# EAGLE design ibdtia (EAGLE 9.4.2)
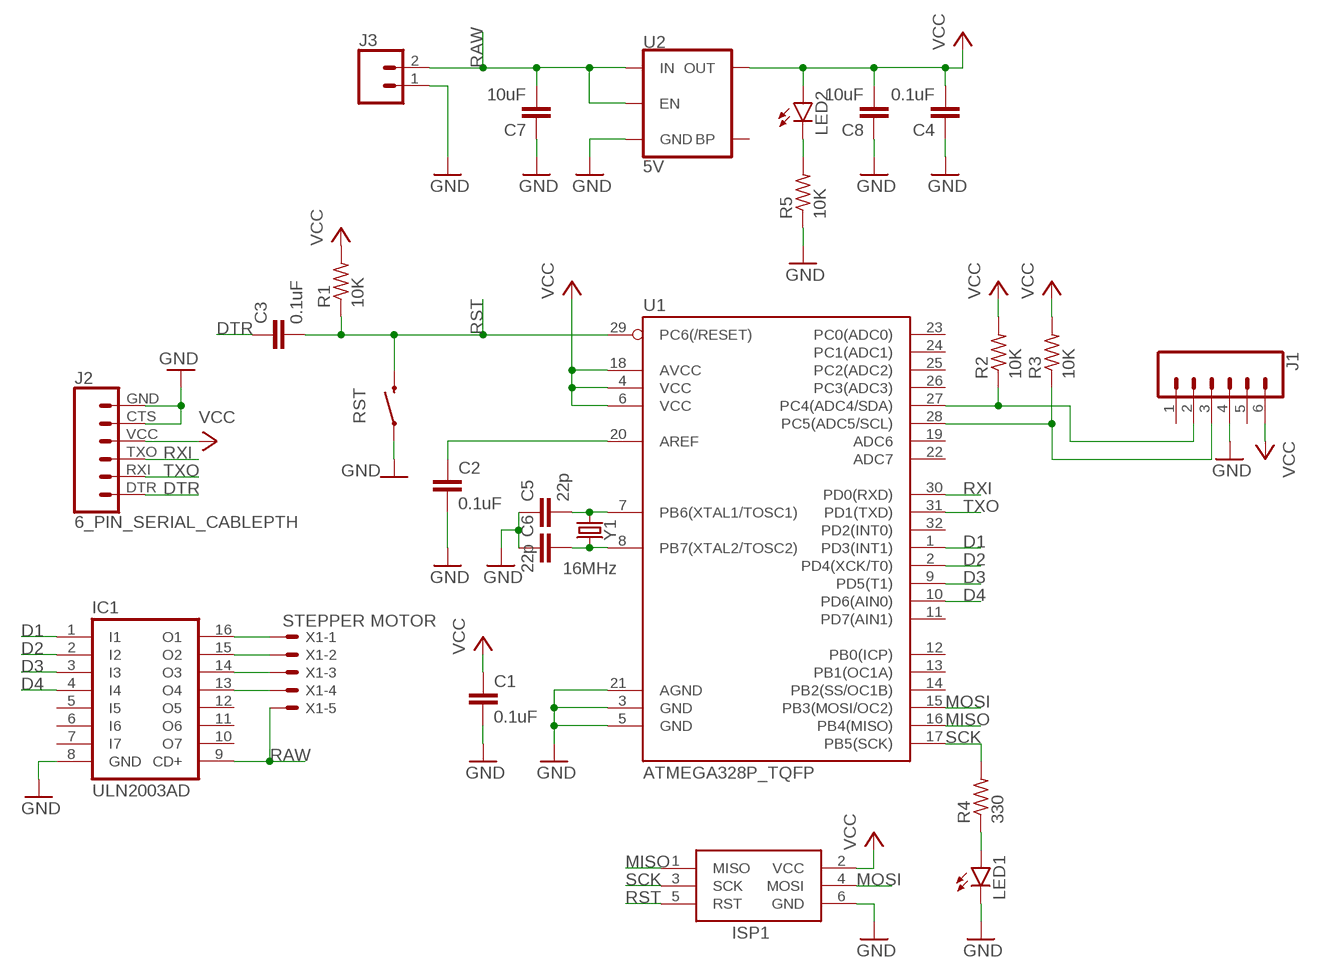
[diagram p0: schematic, sheet 1]

## Parts
C1  0.1uF  C-EUC0805  [C0805]
C2  0.1uF  C-EUC0805  [C0805]
C3  0.1uF  C-EUC0805  [C0805]
C4  0.1uF  C-EUC0805  [C0805]
C5  22p  C-EUC0805  [C0805]
C6  22p  C-EUC0805  [C0805]
C7  10uF  C-EUC0805  [C0805]
C8  10uF  C-EUC0805  [C0805]
IC1  ULN2003AD  [SO16]
ISP1  AVRISP-6  [AVRISP]
J1  CONN_06NO_SILK_FEMALE_PTH  [1X06_NO_SILK]
J2  6_PIN_SERIAL_CABLEPTH  [FTDI_BASIC]
J3  CONN_02  [1X02]
LED1  LEDCHIP-LED0805  [CHIP-LED0805]
LED2  LEDCHIP-LED0805  [CHIP-LED0805]
R1  10K  R-US_R0805  [R0805]
R2  10K  R-US_R0805  [R0805]
R3  10K  R-US_R0805  [R0805]
R4  330  R-US_R0805  [R0805]
R5  10K  R-US_R0805  [R0805]
RST  MOMENTARY-SWITCH-SPST-SMD-4.5MM  [TACTILE_SWITCH_SMD_4.5MM]
U1  ATMEGA328P_TQFP  [TQFP32-08]
U2  5V  V_REG_MIC52055V  [SOT23-5]
X1  STEPPER MOTOR  JST-XH-05-PIN-ROUND-PAD  [JST-XH-05-PACKAGE-ROUND-PAD]
Y1  16MHz  CRYSTAL-16MHZSMD-5X3.2  [CRYSTAL-SMD-5X3.2-4PAD]

## Nets
D1: IC1.1(I1) U1.1(PD3(INT1))
D2: IC1.2(I2) U1.2(PD4(XCK/T0))
D3: IC1.3(I3) U1.9(PD5(T1))
D4: IC1.4(I4) U1.10(PD6(AIN0))
DTR: C3.1 J2.DTR
GND: C1.2 C2.2 C4.1 C5.1 C6.1 C7.1 C8.1 IC1.8(GND) ISP1.6(GND) J1.4 J2.CTS J2.GND J3.1 LED1.C R5.1 RST.2 RST.3 U1.3(GND) U1.5(GND) U1.21(AGND) U2.2(GND)
MISO: ISP1.1(MISO) U1.16(PB4(MISO))
MOSI: ISP1.4(MOSI) U1.15(PB3(MOSI/OC2))
N$2: IC1.16(O1) X1.1
N$3: C5.2 U1.7(PB6(XTAL1/TOSC1)) Y1.1
N$4: C2.1 U1.20(AREF)
N$5: C6.2 U1.8(PB7(XTAL2/TOSC2)) Y1.3
N$6: J1.2 R2.1 U1.27(PC4(ADC4/SDA))
N$7: J1.3 R3.1 U1.28(PC5(ADC5/SCL))
N$8: IC1.15(O2) X1.2
N$9: LED1.A R4.1
N$10: IC1.14(O3) X1.3
N$11: IC1.13(O4) X1.4
N$12: LED2.C R5.2
RAW: C7.2 IC1.9(CD+) J3.2 U2.1(IN) U2.3(EN) X1.5
RST: C3.2 ISP1.5(RST) R1.1 RST.1 RST.4 U1.29(PC6(/RESET))
RXI: J2.TXO U1.30(PD0(RXD))
SCK: ISP1.3(SCK) R4.2 U1.17(PB5(SCK))
TXO: J2.RXI U1.31(PD1(TXD))
VCC: C1.1 C4.2 C8.2 ISP1.2(VCC) J1.6 J2.VCC LED2.A R1.2 R2.2 R3.2 U1.4(VCC) U1.6(VCC) U1.18(AVCC) U2.5(OUT)
Unconnected: IC1.5(I5) IC1.6(I6) IC1.7(I7) IC1.10(O7) IC1.11(O6) IC1.12(O5) J1.1 J1.5 U1.11(PD7(AIN1)) U1.12(PB0(ICP)) U1.13(PB1(OC1A)) U1.14(PB2(SS/OC1B)) U1.19(ADC6) U1.22(ADC7) U1.23(PC0(ADC0)) U1.24(PC1(ADC1)) U1.25(PC2(ADC2)) U1.26(PC3(ADC3)) U1.32(PD2(INT0)) U2.4(BP)

## Library data of the parts
C1-C8 = rcl:C-EU: CAPACITOR, European symbol; SPICEPREFIX: C
IC1 = uln-udn:ULN2003A: DRIVER ARRAY
ISP1 = adafruit:AVRISP: AVR ISP HEADER Standard 6 pin header for AVR programming
J1 = SparkFun-Connectors:CONN_06: Multi connection point. Often used as Generic Header-pin footprint for 0.1 inch spaced/style header connections On any of the 0.1 inch spaced packages, you can populate with these: Break Away Headers - Straight <https://www.sparkfun.com/products/116> (PRT-00116) Break Away Male Headers - Right Angle <https://www.sparkfun.com/products/553> (PRT-00553) Female Headers <https://www.sparkfun.com/products/115> (PRT-00115) Break Away Headers - Machine Pin <https://www.sparkfun.com/products/117> (PRT-00117) Break Away Female Headers - Swiss Machine Pin <https://www.sparkfun.com/products/743> (PRT-00743) Arduino Stackable Header - 6 Pin <https://www.sparkfun.com/products/9280> (PRT-09280) For SCREWTERMINALS and SPRING TERMINALS visit here: Screw Terimnals on SparkFun.com <https://www.sparkfun.com/search/results?term=Screw+Terminals> (5mm/3.5mm/2.54mm spacing) This device is also useful as a general connection point to wire up your design to another part of your project. Our various solder wires solder well into these plated through hole pads. Hook-Up Wire - Assortment (Stranded, 22 AWG) <https://www.sparkfun.com/products/11375> (PRT-11375) Hook-Up Wire - Assortment (Solid Core, 22 AWG) <https://www.sparkfun.com/products/11367> (PRT-11367) View the entire wire category on our website here <https://www.sparkfun.com/categories/141>; PROD_ID: CONN-08437
J2 = SparkFun-Connectors:6_PIN_SERIAL_CABLE: 6-pin header connection for use with the "FTDI BASIC" pinout - CABLE SIDE. Also known as "Arduino Serial Program Header". This is used on a design to provide a 6-pin connection point for serial communication usually from a USB cable (D+/D-) to these headers (RX/TX). It also has the remaining pins necessary for programming in the Arduino evironment (DTR, GND, and sometimes VCC). Note, this device has "CABLE" in the name. It is intended to be used on a design that usually lives on the end of your USB cable and prvides the converter chip (FTDI232 or FTDI231x) to commnicate serial RX/TX. The "sister" device, named "TARGET" is inteneded to be used on a design that contains a target micro-controller that you wish to program. You can populate with some of these: Female Headers <https://www.sparkfun.com/products/115> (PRT-00115) For reference (or to suit your programming needs) check out these designs: SparkFun FTDI Basic Breakout - 5V <https://www.sparkfun.com/products/9716> (DEV-09716) SparkFun FTDI Basic Breakout - 3.3V <https://www.sparkfun.com/products/9873> (DEV-09873) SparkFun FTDI SmartBasic <https://www.sparkfun.com/products/12935> (DEV-12935) SparkFun Beefy 3 - FTDI Basic Breakout <https://www.sparkfun.com/products/13746> (DEV-13746)
J3 = SparkFun-Connectors:CONN_02: Multi connection point. Often used as Generic Header-pin footprint for 0.1 inch spaced/style header connections On any of the 0.1 inch spaced packages, you can populate with these: Break Away Headers - Straight <https://www.sparkfun.com/products/116> (PRT-00116) Break Away Male Headers - Right Angle <https://www.sparkfun.com/products/553> (PRT-00553) Female Headers <https://www.sparkfun.com/products/115> (PRT-00115) Break Away Headers - Machine Pin <https://www.sparkfun.com/products/117> (PRT-00117) Break Away Female Headers - Swiss Machine Pin <https://www.sparkfun.com/products/743> (PRT-00743) For SCREWTERMINALS and SPRING TERMINALS visit here: Screw Terimnals on SparkFun.com <https://www.sparkfun.com/search/results?term=Screw+Terminals> (5mm/3.5mm/2.54mm spacing) This device is also useful as a general connection point to wire up your design to another part of your project. Our various solder wires solder well into these plated through hole pads. Hook-Up Wire - Assortment (Stranded, 22 AWG) <https://www.sparkfun.com/products/11375> (PRT-11375) Hook-Up Wire - Assortment (Solid Core, 22 AWG) <https://www.sparkfun.com/products/11367> (PRT-11367) View the entire wire category on our website here <https://www.sparkfun.com/categories/141> Special notes: Molex polarized connector foot print use with: PRT-08233 with associated crimp pins and housings. 2.54_SCREWTERM for use with PRT-10571. 3.5mm Screw Terminal footprints for PRT-08084 5mm Screw Terminal footprints for use with PRT-08432
LED1 LED2 = led:LED: LED OSRAM: - CHIPLED LG R971, LG N971, LY N971, LG Q971, LY Q971, LO R971, LY R971 LH N974, LH R974 LS Q976, LO Q976, LY Q976 LO Q996 - Hyper CHIPLED LW Q18S LB Q993, LB Q99A, LB R99A - SideLED LS A670, LO A670, LY A670, LG A670, LP A670 LB A673, LV A673, LT A673, LW A673 LH A674 LY A675 LS A676, LA A676, LO A676, LY A676, LW A676 LS A679, LY A679, LG A679 - Hyper Micro SIDELED® LS Y876, LA Y876, LO Y876, LY Y876 LT Y87S - SmartLED LW L88C, LW L88S LB L89C, LB L89S, LG L890 LS L89K, LO L89K, LY L89K LS L896, LA L896, LO L896, LY L896 - TOPLED LS T670, LO T670, LY T670, LG T670, LP T670 LSG T670, LSP T670, LSY T670, LOP T670, LYG T670 LG T671, LOG T671, LSG T671 LB T673, LV T673, LT T673, LW T673 LH T674 LS T676, LA T676, LO T676, LY T676, LB T676, LH T676, LSB T676, LW T676 LB T67C, LV T67C, LT T67C, LS T67K, LO T67K, LY T67K, LW E67C LS E67B, LA E67B, LO E67B, LY E67B, LB E67C, LV E67C, LT E67C LW T67C LS T679, LY T679, LG T679 LS T770, LO T770, LY T770, LG T770, LP T770 LB T773, LV T773, LT T773, LW T773 LH T774 LS E675, LA E675, LY E675, LS T675 LS T776, LA T776, LO T776, LY T776, LB T776 LHGB T686 LT T68C, LB T68C - Hyper Mini TOPLED® LB M676 - Mini TOPLED Santana® LG M470 LS M47K, LO M47K, LY M47K Source: http://www.osram.convergy.de LUXEON: - LUMILED® LXK2-PW12-R00, LXK2-PW12-S00, LXK2-PW14-U00, LXK2-PW14-V00 LXK2-PM12-R00, LXK2-PM12-S00, LXK2-PM14-U00 LXK2-PE12-Q00, LXK2-PE12-R00, LXK2-PE12-S00, LXK2-PE14-T00, LXK2-PE14-U00 LXK2-PB12-K00, LXK2-PB12-L00, LXK2-PB12-M00, LXK2-PB14-N00, LXK2-PB14-P00, LXK2-PB14-Q00 LXK2-PR12-L00, LXK2-PR12-M00, LXK2-PR14-Q00, LXK2-PR14-R00 LXK2-PD12-Q00, LXK2-PD12-R00, LXK2-PD12-S00 LXK2-PH12-R00, LXK2-PH12-S00 LXK2-PL12-P00, LXK2-PL12-Q00, LXK2-PL12-R00 Source: www.luxeon.com KINGBRIGHT: KA-3528ASYC Source: www.kingbright.com
R1-R5 = rcl:R-US_: RESISTOR, American symbol; SPICEPREFIX: R
RST = SparkFun-Switches:MOMENTARY-SWITCH-SPST: Momentary Switch (Pushbutton) - SPST Normally-open (NO) SPST momentary switches (buttons, pushbuttons). Variants PTH-12MM - 12mm square, through-hole Momentary Pushbutton Switch - 12mm Square <https://www.sparkfun.com/products/9190> (COM-09190) PTH-6.0MM, PTH-6.0MM-KIT - 6.0mm square, through-hole Mini Pushbutton Switch <https://www.sparkfun.com/products/97> (COM-00097) KIT package intended for soldering kit's - only one side of pads' copper is exposed. PTH-RIGHT-ANGLE-KIT - Right-angle, through-hole Right Angle Tactile Button <https://www.sparkfun.com/products/10791> - Used on SparkFun BigTime Watch Kit <https://www.sparkfun.com/products/11734> SMD-12MM - 12mm square, surface-mount Tactile Button - SMD (12mm) <https://www.sparkfun.com/products/12993> (COM-12993) Used on SparkFun PicoBoard <https://www.sparkfun.com/products/11888> SMD-4.5MM - 4.5mm Square Trackball Switch Used on SparkFun Blackberry Trackballer Breakout <https://www.sparkfun.com/products/13169> SMD-4.6MMX2.8MM - 4.60mm x 2.80mm, surface mount Used on SparkFun SAMD21 Mini Breakout <https://www.sparkfun.com/products/13664> SMD-5.2MM, SMD-5.2-REDUNDANT - 5.2mm square, surface-mount Mini Pushbutton Switch - SMD <https://www.sparkfun.com/products/8720> (COM-08720) Used on Arduino Pro Mini <https://www.sparkfun.com/products/11114> REDUNDANT package connects both switch circuits together SMD-6.0X3.5MM - 6.0 x 3.5mm, surface mount Momentary Reset Switch SMD <https://www.sparkfun.com/products/8229> (COM-08229) SMD-6.2MM-TALL - 6.2mm square, surface mount Tactile Button - SMD (6mm) <https://www.sparkfun.com/products/12992> Used on SparkFun Digital Sandbox <https://www.sparkfun.com/products/12651> SMD-RIGHT-ANGLE - Right-angle, surface mount Used on SparkFun Block for Intel® Edison - Arduino <https://www.sparkfun.com/products/13036>; PROD_ID: SWCH-09213
U1 = SparkFun-IC-Microcontroller:ATMEGA328P_TQFP: Popular 328P in QFP Storefront component: ATmega328 - TQFP <https://www.sparkfun.com/products/13448> (COM-13448) Datasheet <http://www.sparkfun.com/datasheets/Components/SMD/ATMega328.pdf> SparkFun Products SparkFun RedBoard - Programmed with Arduino <https://www.sparkfun.com/products/12757> (DEV-12757) Arduino Pro Mini 328 - 5V/16MHz <https://www.sparkfun.com/products/11113> (DEV-11113) Arduino Pro Mini 328 - 3.3V/8MHz <https://www.sparkfun.com/products/11114> (DEV-11114) SparkFun OpenLog <https://www.sparkfun.com/products/13712> (DEV-13712) SparkFun MicroView - OLED Arduino Module <https://www.sparkfun.com/products/12923> (DEV-12923) SparkFun Digital Sandbox <https://www.sparkfun.com/products/12651> (DEV-12651) SparkFun PicoBoard <https://www.sparkfun.com/products/11888> (WIG-11888) Arduino Fio <https://www.sparkfun.com/products/10116> (DEV-10116) LilyPad Arduino 328 Main Board <https://www.sparkfun.com/products/13342> (DEV-13342) SparkFun RedStick <https://www.sparkfun.com/products/13741> (DEV-13741) LilyPad MP3 <https://www.sparkfun.com/products/11013> (DEV-11013) LilyPad Arduino SimpleSnap <https://www.sparkfun.com/products/10941> (DEV-10941) SparkFun Stepoko <https://www.sparkfun.com/products/13899> (ROB-13899) SparkFun Geiger Counter <https://www.sparkfun.com/products/11345> (SEN-11345) SparkFun EL Sequencer <https://www.sparkfun.com/products/12781> (COM-12781) Arduino Pro 328 - 5V/16MHz <https://www.sparkfun.com/products/10915> (DEV-10915) CryptoCape <https://www.sparkfun.com/products/12773> (DEV-12773) SparkFun IR Thermometer Evaluation Board - MLX90614 <https://www.sparkfun.com/products/10740> (SEN-10740) SparkFun RedBot Mainboard <https://www.sparkfun.com/products/12097> (ROB-12097) Arduino Pro 328 - 3.3V/8MHz <https://www.sparkfun.com/products/10914> (DEV-10914) SparkFun Block for Intel® Edison - Arduino <https://www.sparkfun.com/products/13036> (DEV-13036) SparkFun Simon Says - Surface Mount Soldering Kit <https://www.sparkfun.com/products/10935> (KIT-10935) SparkFun 7-Segment Serial Display - Red <https://www.sparkfun.com/products/11441> (COM-11441) SparkFun 7-Segment Serial Display - White <https://www.sparkfun.com/products/11629> (COM-11629) SparkFun 7-Segment Serial Display - Yellow <https://www.sparkfun.com/products/11443> (COM-11443) SparkFun 7-Segment Serial Display - Kelly Green <https://www.sparkfun.com/products/11440> (COM-11440) SparkFun 7-Segment Serial Display - Blue <https://www.sparkfun.com/products/11442> (COM-11442) SparkFun OpenSegment Serial Display - 20mm (Blue) <https://www.sparkfun.com/products/11647> (COM-11647) SparkFun OpenSegment Serial Display - 20mm (Green) <https://www.sparkfun.com/products/11646> (COM-11646) SparkFun OpenSegment Serial Display - 20mm (White) <https://www.sparkfun.com/products/11648> (COM-11648) SparkFun OpenSegment Serial Display - 20mm (Red) <https://www.sparkfun.com/products/11644> (COM-11644) SparkFun OpenSegment Serial Display - 20mm (Yellow) <https://www.sparkfun.com/products/11645> (COM-11645) SparkFun OpenSegment Shield <https://www.sparkfun.com/products/13190> (DEV-13190); PROD_ID: IC-09069
U2 = SparkFun-IC-Power:V_REG_MIC5205: V_REG MIC5205 Standard 3.3V, 5V, and Adjustable 150mA LDO voltage regulator in SOT-23 layout. Micrel part MIC5205. BP (by-pass) pin is used to lower output noise with 470pF cap, may be left open. On the adjustable version BP is used to set output.; PROD_ID: VREG-00823
X1 = Rembrandt Electronics - JST XH Connectors v1-0:JST-XH-05-PIN: JST XH Connector 2 Pin Wire to board connector. Pitch: 2,54 mm, (0.100") Number of pins: 5 Created by Rembrandt Electronics www.rembrandtelectronics.com
Y1 = SparkFun-Clocks:CRYSTAL-16MHZ: 16MHz Crystal Digikey Example <http://www.digikey.com/product-search/en?keywords=535-9122-1-ND> Frequency: 16MHz Frequency Stability: ±50ppm Frequency Tolerance: ±20ppm Load Capacitance: 18pF SparkFun Products: Pro Micro -5V/16MHz <https://www.sparkfun.com/products/12640> SparkFun Serial Enabled LCD Kit <https://www.sparkfun.com/products/10097>; PROD_ID: XTAL-08218; SF_ID: COM-00094

## Board
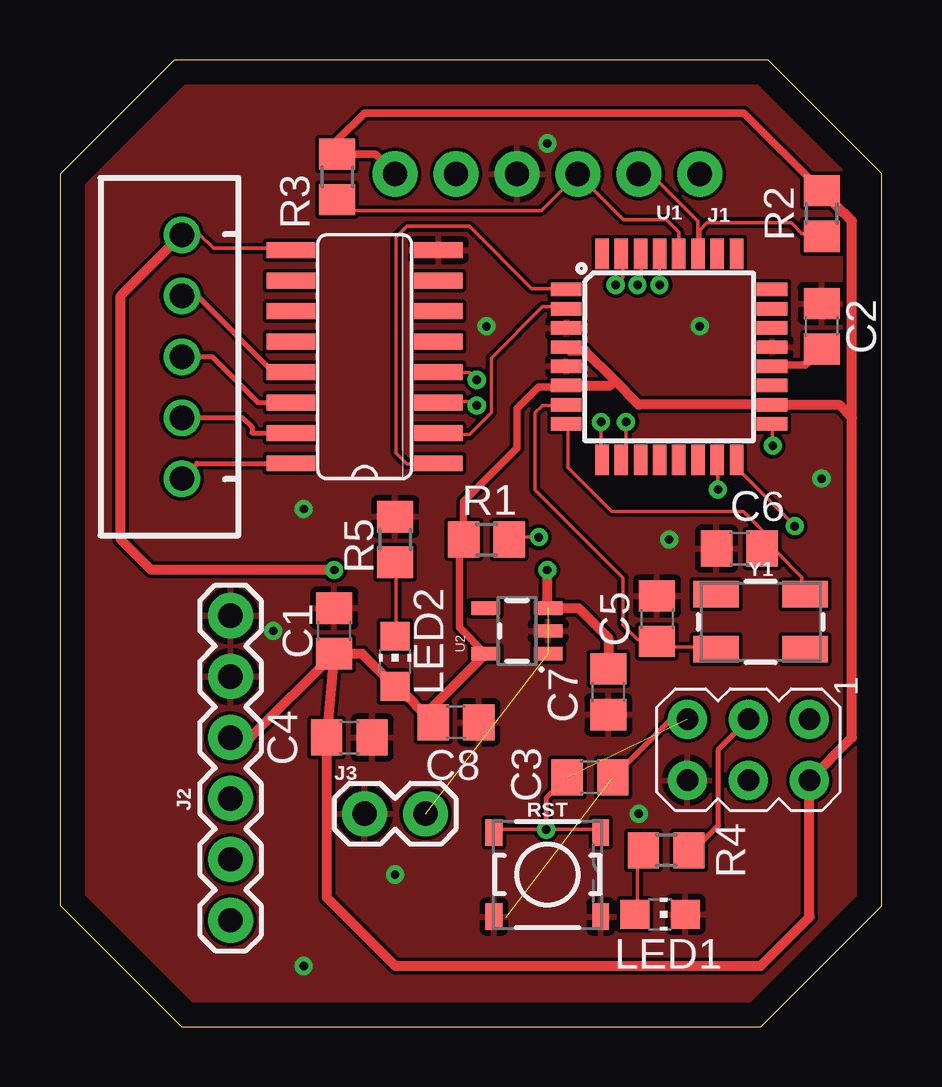
[diagram p1: board, top side]
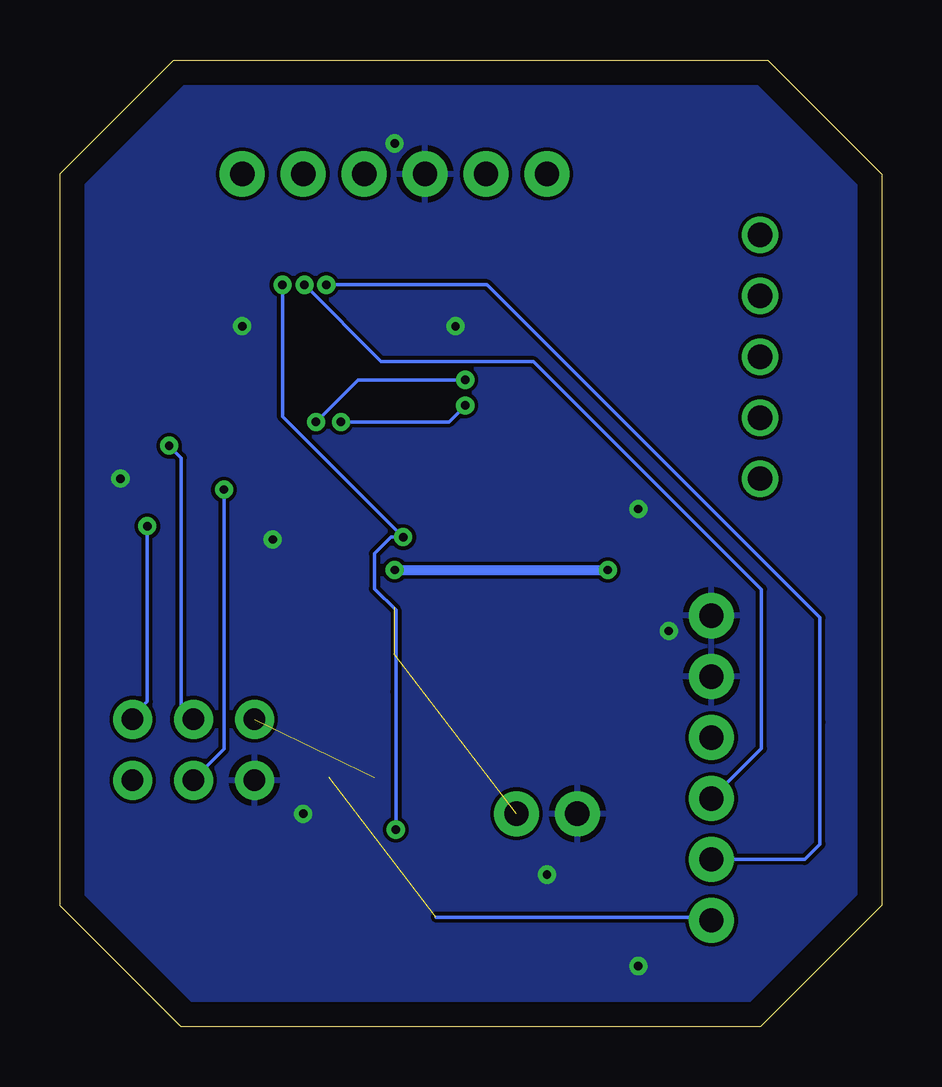
[diagram p2: board, bottom side, seen from below]

Size 34.27 x 40.31 mm. Coordinates in mm from the lower left corner, seen from the top.
Outline: 5.08,0 29.21,0 34.27,5.06 34.27,35.58 29.54,40.31 4.75,40.31 0,35.56 0,5.08 5.08,0
Copper layers (1*16): Top 0.035mm / dielectric 1.5mm / Bottom 0.035mm
Design rules "default": minimum track width 6mil, minimum drill 0.35mm, track to track 6mil, track to pad 6mil, pad to pad 6mil, via to via 6mil, smd to smd 6mil, copper to edge 40mil, drill to drill 6mil, minimum pad ring 10mil, minimum via ring 8mil, stop-mask expansion 4mil, vias tented up to drill 0mil, thermal gap 10mil

### Footprints (pad centres in the part's own frame; a part is rotated, then mirrored left to right if it is on the bottom)
C0805 = smd 1.3 x 1.5: 1 -0.95,0; 2 0.95,0
SO16 = smd 0.66 x 2.032: 1 -4.445,-3.073; 2 -3.175,-3.073; 3 -1.905,-3.073; 4 -0.635,-3.073; 5 0.635,-3.073; 6 1.905,-3.073; 7 3.175,-3.073; 8 4.445,-3.073; 9 4.445,3.073; 10 3.175,3.073; 11 1.905,3.073; 12 0.635,3.073; 13 -0.635,3.073; 14 -1.905,3.073; 15 -3.175,3.073; 16 -4.445,3.073
AVRISP = drill 0.9 pad 1.626: 1 -1.27,2.54; 2 1.27,2.54; 3 -1.27,0; 4 1.27,0; 5 -1.27,-2.54; 6 1.27,-2.54
1X06_NO_SILK = drill 1.016 pad 1.88: 1 0,0; 2 2.54,0; 3 5.08,0; 4 7.62,0; 5 10.16,0; 6 12.7,0
FTDI_BASIC = drill 1.016 pad 1.88: CTS 10.16,0; DTR 0,0; GND 12.7,0; RXI 2.54,0; TXO 5.08,0; VCC 7.62,0
1X02 = drill 1.016 pad 1.88: 1 0,0; 2 2.54,0
CHIP-LED0805 = smd 1.2 x 1.2: A 0,-1.05; C 0,1.05
R0805 = smd 1.3 x 1.5: 1 -0.95,0; 2 0.95,0
TACTILE_SWITCH_SMD_4.5MM = smd 0.7 x 1.1: 1 2.225,1.75; 2 2.225,-1.75; 3 -2.225,-1.75; 4 -2.225,1.75
TQFP32-08 = smd 1.27 x 0.559: 1 -4.293,2.8; 2 -4.293,2; 3 -4.293,1.2; 4 -4.293,0.4; 5 -4.293,-0.4; 6 -4.293,-1.2; 7 -4.293,-2; 8 -4.293,-2.8; 17 4.293,-2.8; 18 4.293,-2; 19 4.293,-1.2; 20 4.293,-0.4; 21 4.293,0.4; 22 4.293,1.2; 23 4.293,2; 24 4.293,2.8 | smd 0.559 x 1.27: 9 -2.8,-4.293; 10 -2,-4.293; 11 -1.2,-4.293; 12 -0.4,-4.293; 13 0.4,-4.293; 14 1.2,-4.293; 15 2,-4.293; 16 2.8,-4.293; 25 2.8,4.293; 26 2,4.293; 27 1.2,4.293; 28 0.4,4.293; 29 -0.4,4.293; 30 -1.2,4.293; 31 -2,4.293; 32 -2.8,4.293
SOT23-5 = smd 0.55 x 1.2: 1 -0.95,-1.3; 2 0,-1.3; 3 0.95,-1.3; 4 0.95,1.3; 5 -0.95,1.3
JST-XH-05-PACKAGE-ROUND-PAD = drill 1.016: 1 -5.08,0; 2 -2.54,0; 3 0,0; 4 2.54,0; 5 5.08,0
CRYSTAL-SMD-5X3.2-4PAD = smd 1.9 x 1.1: 1 -1.85,-1.15; 2 1.85,-1.15; 3 1.85,1.15; 4 -1.85,1.15

### Placement (x,y rotation side)
C1  11.43,16.51 90 top
C2  31.75,29.21 90 top
C3  22.1,10.41 180 top
C4  12.06,12.06 180 top
C5  24.89,17.02 270 top
C6  28.32,19.94 0 top
C7  22.86,13.97 90 top
C8  16.51,12.7 180 top
IC1  12.7,27.94 90 top
ISP1  28.7,11.56 270 top
J1  26.67,35.56 180 top
J2  7.11,4.45 90 top
J3  12.7,8.89 0 top
LED1  25.02,4.7 270 top
LED2  13.97,15.24 0 top
R1  17.78,20.32 180 top
R2  31.75,33.91 90 top
R3  11.56,35.43 90 top
R4  25.27,7.37 0 top
R5  13.97,20.32 270 top
RST  20.32,6.35 0 top
U1  25.4,27.94 0 top
U2  19.05,16.51 90 top
X1  5.08,27.94 90 top
Y1  29.21,16.89 0 top

### Tracks (layer width: path | path; a pad name or v marks a point on that pad's centre or on a via)
D1
  Top 0.152: U1.1 21.03,30.79 19.66,30.79 17.07,33.38 14.48,33.38 14.02,32.92 14.02,23.93 14.48,23.47 15.7,23.47 IC1.1
D2
  Top 0.152: U1.2 21.03,30.02 20.12,30.02 17.98,27.89 17.98,25.6 17.07,24.69 15.85,24.69 IC1.2
D3  (via drill 0.35)
  Top 0.152: v22.55,25.22 22.55,23.77 U1.9 | v17.37,25.91 17.22,26.06 15.85,26.06 IC1.3
  Bottom 0.152: v22.55,25.22 18.06,25.22 v17.37,25.91
D4  (via drill 0.35)
  Top 0.152: v23.6,25.22 23.6,24.01 U1.10 | v17.37,26.98 17.07,27.28 15.85,27.28 IC1.4
  Bottom 0.152: v23.6,25.22 21.84,26.98 v17.37,26.98
DTR  (1 unrouted)
  Top 0.203: C3.1 25.46,12.83
  Bottom 0.152: 18.59,4.57 7.16,4.57 J2.DTR
GND  (via drill 0.35)
  other vias: 13.97,6.35 10.16,2.54 24.13,8.89 10.16,21.59 8.89,16.51 25.4,20.32 31.75,22.86 26.67,29.21 20.32,36.83 17.78,29.21
  pour Top: 0,50.8 40.64,50.8 40.64,-1.27 0,-1.27
  pour Bottom: -1.27,40.64 35.56,40.64 36.83,39.37 36.83,5.08 30.48,-1.27 0,-1.27 -1.27,0
MISO  (via drill 0.35)
  Top 0.152: v30.63,20.88 28.2,23.31 U1.16
  Bottom 0.152: v30.63,20.88 30.63,13.56 31.24,12.95 ISP1.1
MOSI  (via drill 0.35)
  Top 0.152: v27.43,22.4 27.43,23.62 U1.15
  Bottom 0.152: v27.43,22.4 27.43,11.58 28.65,10.36 ISP1.4
N$2
  Top 0.2: X1.1 5.71,23.5 IC1.16
N$3
  Top 0.152: U1.7 21.03,25.91 20.12,25.91 19.81,25.6 19.81,22.38 23.47,18.72 23.47,16.76 24.08,16.15 24.84,16.15 C5.2 24.99,16 25.15,15.85 27.28,15.85 Y1.1
N$4
  Top 0.152: 29.72,27.58 U1.20
  Top 0.305: C2.1 31.07,27.58 29.72,27.58
N$5
  Top 0.152: U1.8 21.18,24.99 21.18,23.32 23.01,21.49 28.5,21.49 29.26,20.73 29.26,19.96 C6.2 29.41,19.81 29.87,19.81 30.94,18.75 30.94,18.14 Y1.3
N$6
  Top 0.152: R2.1 31.7,33.07 30.94,33.07 30.48,33.53 26.98,33.53 26.67,33.22 26.67,32.31 U1.27 26.6,33.6 24.64,35.56 J1.2
N$7
  Top 0.152: R3.1 12,34.04 20.07,34.04 J1.3 23.5,33.66 25.27,33.66 25.8,33.13 U1.28
N$8
  Top 0.2: X1.2 7.62,25.4 8,25.02 8,24.77 IC1.15
N$9
  Top 0.152: LED1.A 24.08,4.72 24.08,7.16 24.23,7.32 R4.1
N$10
  Top 0.2: X1.3 6.35,27.94 8.26,26.04 IC1.14
N$11
  Top 0.2: X1.4 5.71,30.48 8.89,27.3 IC1.13
N$12
  Top 0.152: LED2.C 14.02,16.31 14.02,19.36 R5.2
RAW  (via drill 0.35)  (3 unrouted)
  Top 0.152: IC1.9 9.6,32.46 6.4,32.46 5.79,33.07 5.18,33.07 X1.5
  Top 0.406: 20.32,17.49 v20.32,19.05 | v11.43,19.05 3.81,19.05 2.54,20.32 2.54,30.48 X1.5 | U2.3 21.62,17.46 22.86,16.22 C7.2
  Bottom 0.406: v20.32,19.05 v11.43,19.05
RST  (via drill 0.35)  (1 unrouted)
  Top 0.152: v24.99,30.94 24.99,32.16 U1.29 | v19.96,20.42 18.75,20.42 R1.1 | RST.4 18.14,8.23 v20.27,8.23 22.25,8.23 22.4,8.38 22.55,8.23 RST.1
  Top 0.203: C3.2 20.27,9.54 v20.27,8.23
  Bottom 0.152: v24.99,30.94 24.99,25.45 v19.96,20.42 20.47,20.42 21.16,19.74 21.16,18.26 20.27,17.37 20.27,13.97 v20.27,8.23
RXI  (via drill 0.35)
  Top 0.152: v24.08,30.94 24.23,31.09 24.23,32.16 U1.30
  Bottom 0.152: v24.08,30.94 20.88,27.74 14.53,27.74 5.03,18.24 5.03,11.61 J2.TXO
SCK  (via drill 0.35)
  Top 0.152: R4.2 26.36,7.32 | v29.72,24.23 29.69,24.26 U1.17
  Top 0.2: 26.36,7.32 27.45,8.4 27.45,11.57 ISP1.3
  Bottom 0.152: ISP1.3 29.21,13.34 29.21,23.72 v29.72,24.23
TXO  (via drill 0.35)
  Top 0.152: v23.16,30.94 23.47,31.24 23.47,32.16 U1.31
  Bottom 0.152: v23.16,30.94 16.46,30.94 2.59,17.07 2.59,12.7 2.59,7.62 3.23,6.99 J2.RXI
VCC
  Top 0.152: 21.59,26.67 21.18,26.67 U1.6 | 31.7,34.9 R2.2
  Top 0.305: 21.59,26.67 19.94,26.67 19.05,25.78 19.05,24.13 16.83,21.91 R1.2 16.66,20.14 16.66,16.66 U2.5 | R2.2 28.51,38.1 12.7,38.1 11.56,36.96 R3.2 13.15,36.38 J1.6
  Top 0.406: U2.5 15.56,13.37 C8.2 14.07,14.19 LED2.A 12.6,15.56 C1.1 | C1.1 7.93,12.06 J2.VCC | C1.1 C4.2 11.12,5.39 13.97,2.54 29.21,2.54 31.24,4.57 ISP1.2 33.02,12.06 33.02,25.4 | 31.7,34.9 32.63,33.97 32.65,33.97 33.02,33.59 33.02,25.4 | 33.02,25.4 32.48,25.94 U1.18 24.12,25.94 23.13,26.94 | U1.4 21.27,28.18 21.89,28.18 23.13,26.94 | U1.6 22.93,26.74 23.13,26.94